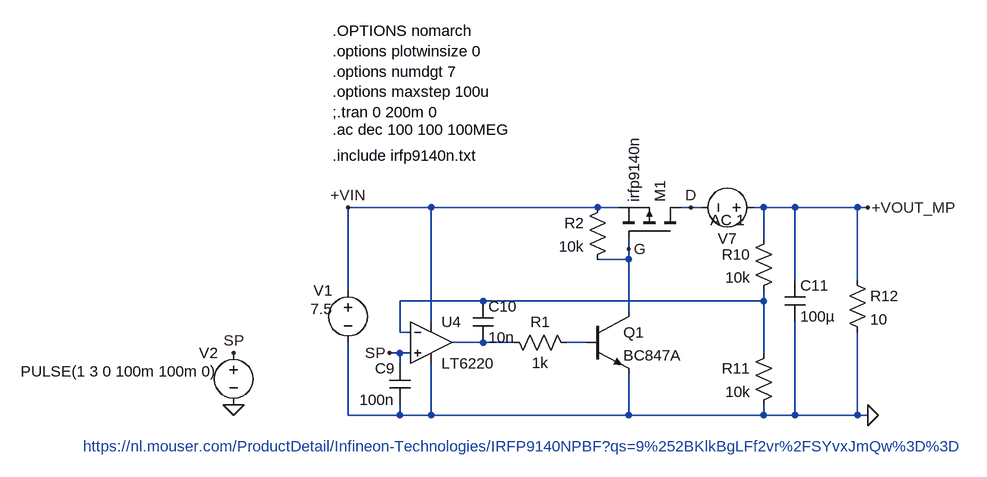
[diagram p0: schematic PMOS_lin_reg - V1.asc]
PMOS_lin_reg - V1.asc, the LTspice schematic file:
Version 4
SHEET 1 4944 2476
WIRE 896 -2032 768 -2032
WIRE 1152 -2032 896 -2032
WIRE 1184 -2032 1152 -2032
WIRE 1296 -2032 1280 -2032
WIRE 1312 -2032 1296 -2032
WIRE 1408 -2032 1392 -2032
WIRE 1456 -2032 1408 -2032
WIRE 1552 -2032 1456 -2032
WIRE 1568 -2032 1552 -2032
WIRE 1408 -1984 1408 -2032
WIRE 1200 -1968 1200 -1984
WIRE 1200 -1952 1200 -1968
WIRE 1200 -1952 1152 -1952
WIRE 1456 -1920 1456 -2032
WIRE 1552 -1920 1552 -2032
WIRE 768 -1904 768 -2032
WIRE 976 -1888 848 -1888
WIRE 1408 -1888 1408 -1904
WIRE 1408 -1888 976 -1888
WIRE 1200 -1872 1200 -1952
WIRE 896 -1856 896 -2032
WIRE 848 -1840 848 -1888
WIRE 864 -1840 848 -1840
WIRE 976 -1824 928 -1824
WIRE 1024 -1824 976 -1824
WIRE 1136 -1824 1104 -1824
WIRE 848 -1808 832 -1808
WIRE 864 -1808 848 -1808
WIRE 1408 -1808 1408 -1888
WIRE 848 -1792 848 -1808
WIRE 768 -1712 768 -1824
WIRE 848 -1712 848 -1728
WIRE 848 -1712 768 -1712
WIRE 896 -1712 896 -1792
WIRE 896 -1712 848 -1712
WIRE 1200 -1712 1200 -1776
WIRE 1200 -1712 896 -1712
WIRE 1408 -1712 1408 -1728
WIRE 1408 -1712 1200 -1712
WIRE 1456 -1712 1456 -1856
WIRE 1456 -1712 1408 -1712
WIRE 1552 -1712 1552 -1840
WIRE 1552 -1712 1456 -1712
WIRE 1568 -1712 1552 -1712
FLAG 768 -2032 +VIN
FLAG 592 -1728 0
FLAG 592 -1808 SP
FLAG 1568 -1712 0
FLAG 1568 -2032 +VOUT_MP
FLAG 1296 -2032 D
FLAG 832 -1808 SP
FLAG 1200 -1968 G
DATAFLAG 1504 -2032 "round($/1m)*1m"
DATAFLAG 848 -2032 "round($/1m)*1m"
DATAFLAG 1120 -1824 "round($/1m)*1m"
DATAFLAG 1104 -1888 "round($/1m)*1m"
SYMBOL voltage 768 -1920 M0
WINDOW 123 0 0 Left 0
WINDOW 39 0 0 Left 0
WINDOW 3 24 44 Left 2
SYMATTR Value 7.5
SYMATTR InstName V1
SYMBOL voltage 592 -1824 M0
WINDOW 123 0 0 Left 0
WINDOW 39 0 0 Left 0
WINDOW 3 24 44 Left 2
SYMATTR Value PULSE(1 3 0 100m 100m 0)
SYMATTR InstName V2
SYMBOL cap 864 -1792 M0
SYMATTR InstName C9
SYMATTR Value 100n
SYMBOL voltage 1408 -2032 M270
WINDOW 0 -32 56 VBottom 2
WINDOW 3 32 56 VTop 2
WINDOW 123 -4 56 VBottom 2
WINDOW 39 0 0 Left 0
SYMATTR InstName V7
SYMATTR Value ""
SYMATTR Value2 AC 1
SYMBOL cap 960 -1824 M180
WINDOW 0 24 56 Left 2
WINDOW 3 24 8 Left 2
SYMATTR InstName C10
SYMATTR Value 10n
SYMBOL cap 1440 -1920 R0
SYMATTR InstName C11
SYMATTR Value 100µ
SYMATTR SpiceLine Rser=10m
SYMBOL res 1424 -2000 M0
SYMATTR InstName R10
SYMATTR Value 10k
SYMBOL res 1424 -1824 M0
SYMATTR InstName R11
SYMATTR Value 10k
SYMBOL OpAmps\\LT6220 896 -1824 R0
SYMATTR InstName U4
SYMBOL res 1536 -1936 R0
SYMATTR InstName R12
SYMATTR Value 10
SYMBOL npn 1136 -1872 R0
SYMATTR InstName Q1
SYMATTR Value BC847A
SYMBOL res 1120 -1808 M270
WINDOW 0 32 56 VTop 2
WINDOW 3 0 56 VBottom 2
SYMATTR InstName R1
SYMATTR Value 1k
SYMBOL pmos 1280 -1984 M270
SYMATTR InstName M1
SYMATTR Value irfp9140n
SYMATTR Prefix X
SYMBOL res 1168 -2048 M0
SYMATTR InstName R2
SYMATTR Value 10k
TEXT 744 -2304 Left 2 !.OPTIONS nomarch\n.options plotwinsize 0\n.options numdgt 7\n.options maxstep 100u\n;.tran 0 200m 0
TEXT 744 -2152 Left 2 !.ac dec 100 100 100MEG
TEXT 744 -2112 Left 2 !.include irfp9140n.txt
TEXT 360 -1664 Left 2 ;https://nl.mouser.com/ProductDetail/Infineon-Technologies/IRFP9140NPBF?qs=9%252BKlkBgLFf2vr%2FSYvxJmQw%3D%3D

The netlist it stands for:
* PMOS_lin_reg - V1.asc
V1 +VIN 0 7.5
V2 SP 0 PULSE(1 3 0 100m 100m 0)
C9 SP 0 100n
V7 +VOUT_MP D AC 1
C10 N002 N001 10n
C11 +VOUT_MP 0 100µ Rser=10m
R10 +VOUT_MP N001 10k
R11 N001 0 10k
XU4 SP N001 +VIN 0 N002 LT6220  ; pins In+ In- V+ V- OUT
R12 +VOUT_MP 0 10
Q1 G N003 0 0 BC847A
R1 N003 N002 1k
XM1 D G +VIN irfp9140n  ; pins D G S
R2 +VIN G 10k
.model NPN NPN
.model PNP PNP
.lib standard.bjt
.OPTIONS nomarch
.options plotwinsize 0
.options numdgt 7
.options maxstep 100u
;.tran 0 200m 0
.ac dec 100 100 100MEG
.include irfp9140n.txt
* https://nl.mouser.com/ProductDetail/Infineon-Technologies/IRFP9140NPBF?qs=9%252BKlkBgLFf2vr%2FSYvxJmQw%3D%3D
.lib LTC4.lib
.backanno
.end